# Altium schematic sheet 发射控制电路.SchDoc
size A4
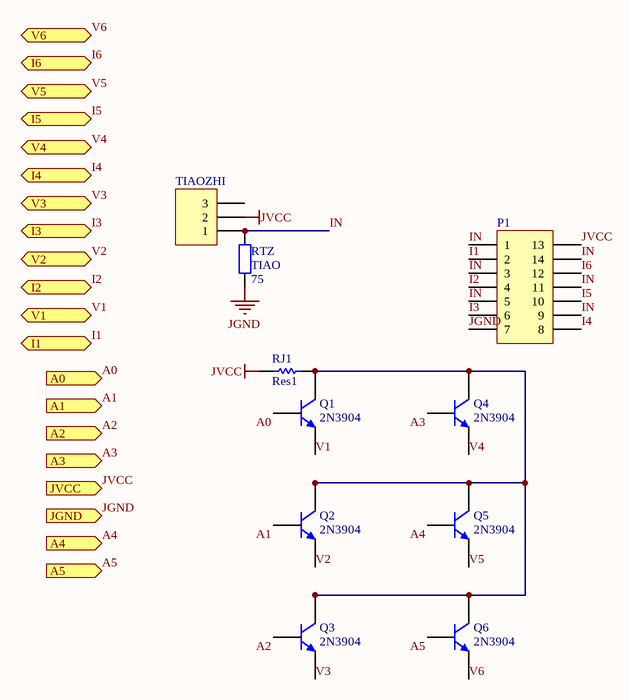
[diagram p0: 发射控制电路.SchDoc]

## Parts
P1  Header 7X2A  [74LS04SOP]  (value not drawn)
Q1  2N3904  [3904]
Q2  2N3904  [3904]
Q3  2N3904  [3904]
Q4  2N3904  [3904]
Q5  2N3904  [3904]
Q6  2N3904  [3904]
RJ1  Res1  [0805]
RTZ  TIAO  value 75  [0805]
TIAOZHI  Header 3  [TIAOZHI]  (value not drawn)

## Ports
A0 (in), A1 (in), A2 (in), A3 (in), A4 (in), A5 (in), I1 (out), I2 (out), I3 (out), I4 (out), I5 (out), I6 (out), JGND (in), JVCC (in), V1 (out), V2 (out), V3 (out), V4 (out), V5 (out), V6 (out)

## Nets
JGND: P1.7 RTZ.1 ; port JGND
JVCC: P1.14(13) RJ1.1 TIAOZHI.2 ; port JVCC
A0: Q1.2(E) ; port A0
A1: Q2.2(B) ; port A1
A2: Q3.2(E) ; port A2
A3: Q4.2(E) ; port A3
A4: Q5.2(E) ; port A4
A5: Q6.2(E) ; port A5
I1: P1.2 ; port I1
I2: P1.4 ; port I2
I3: P1.6 ; port I3
I4: P1.8 ; port I4
I5: P1.10 ; port I5
I6: P1.12 ; port I6
IN: P1.1 P1.3 P1.5 P1.9 P1.11 P1.13(14) RTZ.2 TIAOZHI.1
V1: Q1.1(B) ; port V1
V2: Q2.1(E) ; port V2
V3: Q3.1(B) ; port V3
V4: Q4.1(B) ; port V4
V5: Q5.1(B) ; port V5
V6: Q6.1(B) ; port V6
NetQ1_3: Q1.3(C) Q2.3(C) Q3.3(C) Q4.3(C) Q5.3(C) Q6.3(C) RJ1.2

Not connected (* = marked no-connect by the designer): TIAOZHI 3

## Library data of the parts
P1 = Header 7X2A: Header, 7-Pin, Dual row; LatestRevisionDate: 17-Jul-2002; LatestRevisionNote: Re-released for DXP Platform.; Publisher: Altium Limited
Q1-Q6 = 2N3904: NPN General Purpose Amplifier; Published: 8-Jun-2000; LatestRevisionDate: 15-Jan-2003; LatestRevisionNote: PCB Footprint 'BCY-W3/D4.7' replaced; DatasheetDocument: 1997; PackageDocument: Sep-1998; PackageReference: TO-92A; Publisher: Altium Limited; Code_JEDEC: TO-92A; ComponentLink1Description: Manufacturer Link; ComponentLink1URL: http://www.fairchildsemi.com/; ComponentLink2Description: Datasheet; ComponentLink2URL: http://www.fairchildsemi.com/ds/2N%2F2N3904.pdf
RJ1 = Res1: Resistor; Value: 1K; Published: 8-Jun-2000; LatestRevisionDate: 17-Jul-2002; LatestRevisionNote: Re-released for DXP Platform.; PackageReference: AXIAL-0.3; Publisher: Altium Limited
RTZ = Res2: Resistor; Published: 8-Jun-2000; LatestRevisionDate: 17-Jul-2002; LatestRevisionNote: Re-released for DXP Platform.; PackageReference: AXIAL-0.4; Publisher: Altium Limited
TIAOZHI = Header 3: Header, 3-Pin; LatestRevisionDate: 17-Jul-2002; LatestRevisionNote: Re-released for DXP Platform.; Publisher: Altium Limited